# Altium schematic sheet JacdacRotary 26.SchDoc: Complete design
size A4; DocumentNumber: 1; SheetNumber: 1; SheetTotal: 1; VersionControl_RevNumber: 1
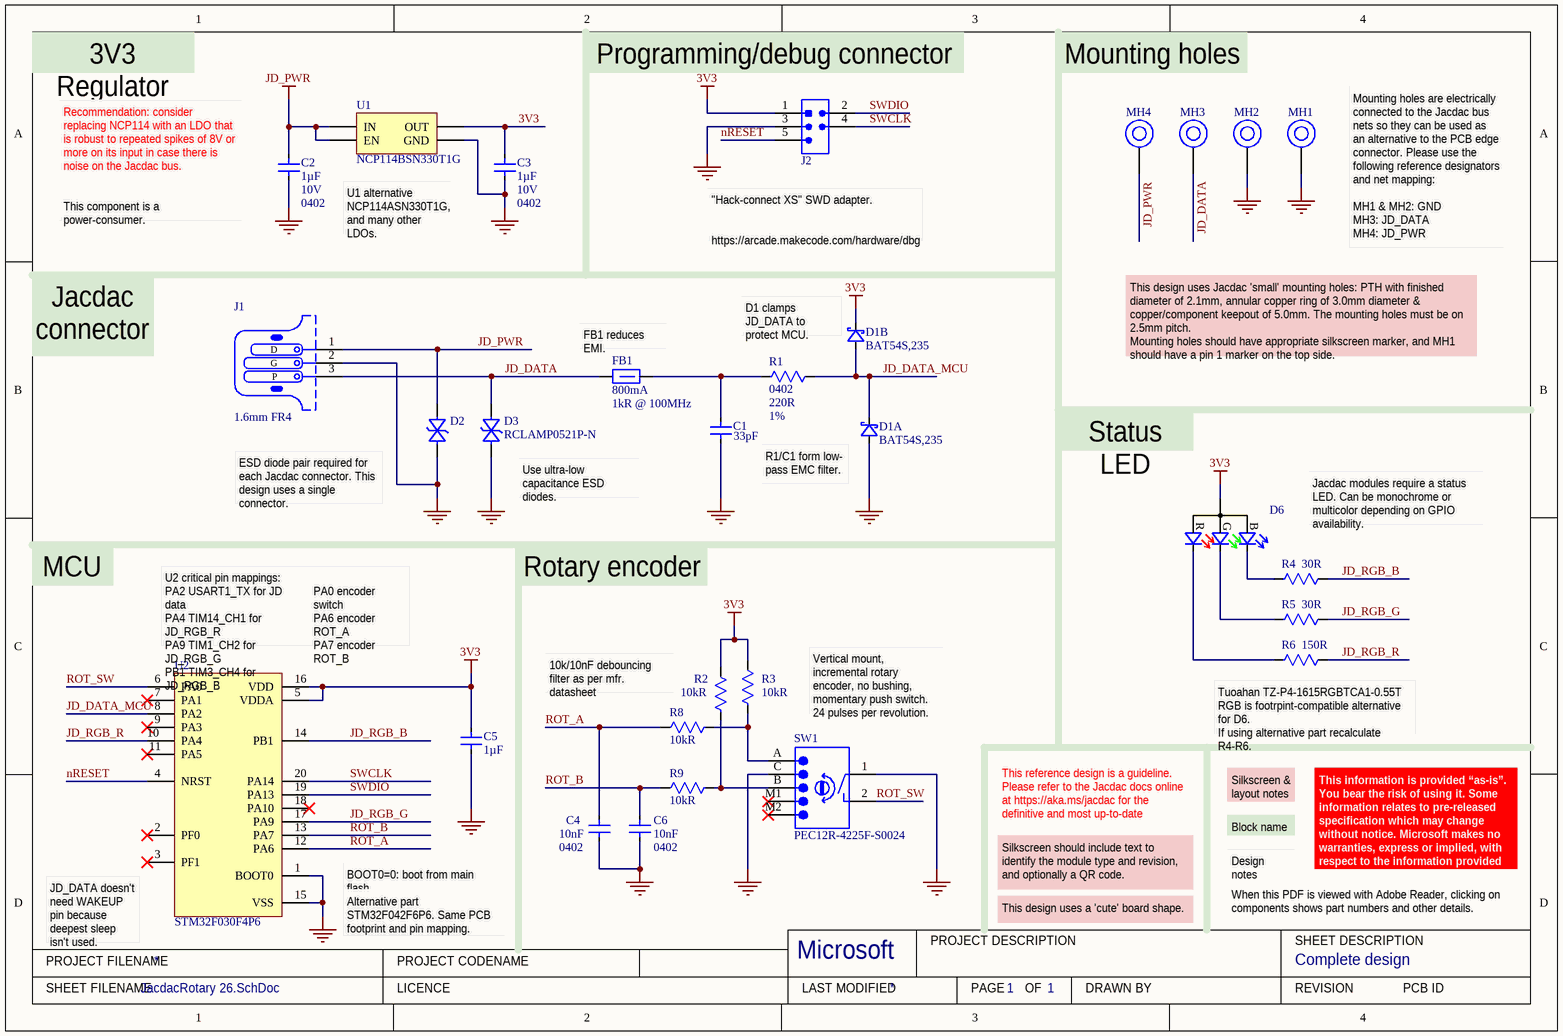
[diagram p0: JacdacRotary 26.SchDoc]

## Parts
C1  Capacitance: 33pF  [C0402_0.55MM - without outline]  (hidden comment: CL05C330JB5NNNC)
C2  Capacitance: 1µF  Voltage Rating: 10V  Case Code (Imperial): 0402  [C0402_0.55MM - without outline]  (hidden comment: CL05A105KP5NNNC)
C3  Capacitance: 1µF  Voltage Rating: 10V  Case Code (Imperial): 0402  [C0402_0.55MM - without outline]  (hidden comment: CL05A105KP5NNNC)
C4  Capacitance: 10nF  Case Code (Imperial): 0402  [C0402_0.55MM - without outline]  (hidden comment: CL05B103JO5NNNC)
C5  Capacitance: 1µF  [C0402_0.55MM - without outline]  (hidden comment: CL05A105KP5NNNC)
C6  Capacitance: 10nF  Case Code (Imperial): 0402  [C0402_0.55MM - without outline]  (hidden comment: CL05B103JO5NNNC)
D1  Manufacturer Part Number: BAT54S,235  [NXP-BAT54S-TO-236AB - without outline]  (hidden comment: BAT54S)  (parts A,B of 2)
D2  RCLAMP0521P-N  [TVS 0402 - L]  (value not drawn)
D3  RCLAMP0521P-N  [TVS 0402 - L]
D6  TZ-P4-1615RGBTCA1-0.55T  [TZ-P4-1615RGBTCA1-0.55T]  (value not drawn)
FB1  Current Rating: 800mA  Impedance: 1kR @ 100MHz  [TDK MPZ1608 0.8mm - without outline]  (hidden comment: TDK MPZ1608S102ATA00)
J1  PCB Type: 1.6mm FR4  [JACDAC_EDGE_CONNECTOR_NO_TRACES]  (hidden comment: 3 pin JACDAC edge connector)  (no BOM)
J2  Hack Connect Mini 1.27 mm pitch 2-row  [HACK_CONNECT_MINI_5_X_1_27]  (value not drawn)  (no BOM)
MH1  MH_5.0MMK_3.0MMC_2.1MMD_PTH  [MH_5.0MMK_3.0MMC_2.1MMD_PTH]  (value not drawn)  (no BOM)
MH2  MH_5.0MMK_3.0MMC_2.1MMD_PTH  [MH_5.0MMK_3.0MMC_2.1MMD_PTH]  (value not drawn)  (no BOM)
MH3  MH_5.0MMK_3.0MMC_2.1MMD_PTH  [MH_5.0MMK_3.0MMC_2.1MMD_PTH]  (value not drawn)  (no BOM)
MH4  MH_5.0MMK_3.0MMC_2.1MMD_PTH  [MH_5.0MMK_3.0MMC_2.1MMD_PTH]  (value not drawn)  (no BOM)
R1  Case Code (Imperial): 0402  Resistance: 220R  Tolerance: 1%  [R0402 - Without outline]  (hidden comment: RC0402FR-07220RL)
R2  Resistance: 10kR  [R0402 - Without outline]  (hidden comment: 10k)
R3  Resistance: 10kR  [R0402 - Without outline]  (hidden comment: 10k)
R4  Resistance: 30R  [R0402 - Without outline]  (hidden comment: RC0402FR-0730RL)
R5  Resistance: 30R  [R0402 - Without outline]  (hidden comment: RC0402FR-0730RL)
R6  Resistance: 150R  [R0402 - Without outline]  (hidden comment: RC0402FR-07150RL)
R8  Resistance: 10kR  [R0402 - Without outline]  (hidden comment: 10k)
R9  Resistance: 10kR  [R0402 - Without outline]  (hidden comment: 10k)
SW1  PEC12R-4225F-S0024  [PEC12R-4225F-S0024 -Standoff 2.4mm- Slotted MH]
U1  LDO 3.3V/300 mA  [ON_SEMI-SOT23-5 - without outline]  (value not drawn)
U2  STM32F030F4P6  [20-TSSOP - without outline]

## Nets
3V3: C3.2 C5.2 D1.2(K) D6.1(A) J2.1(VCC) R2.1 R3.1 U1.5(OUT) U2.5(VDDA) U2.16(VDD)
GND: C1.1 C2.1 C3.1 C4.1 C5.1 C6.1 D1.1(A) D2.2(A) D3.2(A) J1.2(G) J2.3(GND) MH1.1 MH2.1 SW1.1 SW1.C U1.2(GND) U2.1(BOOT0) U2.15(VSS)
JD_PWR: C2.2 D2.1(K) J1.1(D) MH4.1 U1.1(IN) U1.3(EN)
JD_DATA: D3.1(K) FB1.1 J1.3(P) MH3.1
JD_DATA_MCU: D1.3(K) R1.1 U2.8(PA2)
JD_RGB_B: R4.2 U2.14(PB1)
JD_RGB_G: R5.2 U2.17(PA9)
JD_RGB_R: R6.2 U2.10(PA4)
nRESET: J2.5(RESET) U2.4(NRST)
ROT_A: C4.2 R8.1 U2.12(PA6)
ROT_B: C6.2 R9.1 U2.13(PA7)
ROT_SW: SW1.2 U2.6(PA0)
SWCLK: J2.4(SWCLK) U2.20(PA14)
SWDIO: J2.2(SWDIO) U2.19(PA13)
NetC1_2: C1.2 FB1.2 R1.2
NetD6_2: D6.2(R) R6.1
NetD6_3: D6.3(G) R5.1
NetD6_4: D6.4(B) R4.1
NetR2_2: R2.2 R9.2 SW1.B
NetR3_2: R3.2 R8.2 SW1.A

Not connected (* = marked no-connect by the designer): SW1 M1* M2*; U2 2(PF0)* 3(PF1)* 7(PA1)* 9(PA3)* 11(PA5)* 18(PA10)*

## Notes on the sheet
- 3V3 Regulator
- (near J2) Programming/debug connector
- Mounting holes
- (near C2) Recommendation: consider replacing NCP114 with an LDO that is robust to repeated spikes of 8V or more on its input in case there is noise on the Jacdac bus.
- (near C2) This component is a power-consumer.
- U1 alternative
  NCP114ASN330T1G, and many other LDOs.
- (near J2) "Hack-connect XS" SWD adapter.
  https://arcade.makecode.com/hardware/dbg
- MH1 & MH2: GND
  MH3: JD_DATA
  MH4: JD_PWR
- (near MH1) Mounting holes are electrically connected to the Jacdac bus nets so they can be used as an alternative to the PCB edge connector. Please use the following reference designators and net mapping:
- Jacdac
  connector
- (near FB1) FB1 reduces EMI.
- (near D1) D1 clamps JD_DATA to protect MCU.
- This design uses Jacdac 'small' mounting holes: PTH with finished diameter of 2.1mm, annular copper ring of 3.0mm diameter & copper/component keepout of 5.0mm. The mounting holes must be on 2.5mm pitch.
  Mounting holes should have appropriate silkscreen marker, and MH1 should have a pin 1 marker on the top side.
- Status LED
- ESD diode pair required for each Jacdac connector. This design uses a single connector.
- (near D3) Use ultra-low capacitance ESD diodes.
- (near D1) R1/C1 form low-
  pass EMC filter.
- Jacdac modules require a status LED. Can be monochrome or multicolor depending on GPIO availability.
- MCU
- Rotary encoder
- (near U2) U2 critical pin mappings:
  PA2 USART1_TX for JD data
  PA4 TIM14_CH1 for JD_RGB_R
  PA9 TIM1_CH2 for JD_RGB_G
  PB1 TIM3_CH4 for JD_RGB_B
- (near U2) PA0 encoder switch
  PA6 encoder ROT_A
  PA7 encoder ROT_B
- 10k/10nF debouncing filter as per mfr. datasheet
- Vertical mount, incremental rotary encoder, no bushing, momentary push switch. 24 pulses per revolution.
- (near R6) Tuoahan TZ-P4-1615RGBTCA1-0.55T RGB is footrpint-compatible alternative for D6.
  If using alternative part recalculate R4-R6.
- This reference design is a guideline. Please refer to the Jacdac docs online at https://aka.ms/jacdac for the definitive and most up-to-date information.
- Block name
- Silkscreen & layout notes
- BOOT0=0: boot from main flash.
- This design uses a 'cute' board shape.
- Silkscreen should include text to identify the module type and revision, and optionally a QR code.
- Design notes
- When this PDF is viewed with Adobe Reader, clicking on components shows part numbers and other details.
- This information is provided “as-is”. You bear the risk of using it. Some information relates to pre-released specification which may change without notice. Microsoft makes no warranties, express or implied, with respect to the information provided here.
- (near U2) JD_DATA doesn't need WAKEUP pin because deepest sleep isn't used.
- Alternative part STM32F042F6P6. Same PCB footprint and pin mapping.
- PROJECT FILENAME
- PROJECT CODENAME
- Microsoft
- PROJECT DESCRIPTION
- SHEET DESCRIPTION
- SHEET FILENAME
- LICENCE
- LAST MODIFIED
- PAGE
- OF
- DRAWN BY
- REVISION
- PCB ID

## Library data of the parts
C1 = CL05C330JB5NNNC: CAP CER 33PF 50V C0G/NP0 0402; Manufacturer: Samsung; Material: Ceramic; Tolerance: 5%; Dielectric: C0G; Temperature Coefficient: 300ppm/°C; Supplier 1: Digi-Key; Manufacturer Part Number: CL05C330JB5NNNC; RoHS: Yes; Category: Ceramic Capacitors; Stock 1: 5436088; Pricing 1: 1=0.10000, 10=0.02300, 50=0.01260, 100=0.01040, 500=0.00740, 1000=0.00582, 2500=0.00529, 5000=0.00487 (USD); Mount: Surface Mount; Case Code (Metric): 1005; Case Code (Imperial): 0402; Contact Plating: Tin; Min Operating Temperature: -55°C; Max Operating Temperature: 125°C; Package Quantity: 1; Packaging: Tape and Reel; Voltage: 50V; Voltage Rating (DC): 50V; Series: CL; Construction: Flat; Length: 1mm; Width: 0.02inch; Height: 0.5mm; Thickness: 0.022inch; Depth: 0.5mm; Radiation Hardening: No; Lead Free: Lead Free; RoHS Compliant: Yes; ComponentLink1URL: https://datasheet.ciiva.com/15195/getdatasheetpartid-355282-15195687.pdf; ComponentLink1Description: Online datasheet; Supplier 2: Newark; Stock 2: 45340; Pricing 2: 1=0.12500, 25=0.02900, 100=0.01300, 250=0.01100, 500=0.00900, 1000=0.00600 (USD); Supplier 3: Mouser; Stock 3: 8877; Pricing 3: 1=0.10000, 10=0.01400, 50=0.01400, 100=0.01100, 1000=0.00600, 10000=0.00400 (USD); Supplier 4: Farnell; Stock 4: 10934; Pricing 4: 150=0.01120, 500=0.00860, 2500=0.00640, 5000=0.00550 (GBP); Supplier Part Number 4: 3013373RL; Supplier Part Number 3: 187-CL05C330JB5NNNC; Supplier Part Number 2: 82AC9259; Supplier Part Number 1: 1276-1272-1-ND; Voltage Rating: 50V; Case/Package: 0402
C2 C3 C5 = CL05A105KP5NNNC: CAP CER 1UF 10V X5R 0402; Manufacturer: Samsung; Material: Ceramic; Tolerance: 10%; Supplier 1: Digi-Key; Manufacturer Part Number: CL05A105KP5NNNC; RoHS: Yes; Category: Capacitors; Stock 1: 5705569; Pricing 1: 1=0.10000, 10=0.03900, 50=0.02100, 100=0.01720, 500=0.01228, 1000=0.00965, 2500=0.00877, 5000=0.00807 (USD); Mount: Surface Mount; Case/Package: 0402; Case Code (Metric): 1005; Contact Plating: Tin; Min Operating Temperature: -55°C; Max Operating Temperature: 85°C; Dielectric: X5R; Package Quantity: 1; Packaging: Tape and Reel; Length: 1mm; Height: 0.5mm; Width: 0.02inch; Thickness: 0.022inch; Depth: 0.5mm; Radiation Hardening: No; ComponentLink1URL: https://datasheet.ciiva.com/15195/getdatasheetpartid-358390-15195630.pdf; ComponentLink1Description: Online datasheet; Supplier 2: Mouser; Stock 2: 928941; Pricing 2: 1=0.10000, 10=0.04200, 100=0.01800, 500=0.01300, 1000=0.01000, 2500=0.00900 (USD); Supplier 3: Farnell; Stock 3: 53670; Pricing 3: 10=0.02450, 100=0.02000, 500=0.01310, 2500=0.00920, 5000=0.00810, 10000=0.00640, 50000=0.00490 (GBP); Supplier Part Number 3: 3013329; Supplier Part Number 2: 187-CL05A105KP5NNNC; Supplier Part Number 1: 1276-1076-1-ND; Created: DG; Checked: ?
  C5: Voltage Rating: 10V; Case Code (Imperial): 0402
C4 C6 = CL05B103JO5NNNC: CAP CER 10000PF 16V X7R 0402; Manufacturer: Samsung; Tolerance: 5%; Supplier 1: Digi-Key; Manufacturer Part Number: CL05B103JO5NNNC; RoHS: Yes; Category: Ceramic Capacitors; Stock 1: 24167; Pricing 1: 1=0.10000, 10=0.02800, 50=0.01520, 100=0.01250, 500=0.00890, 1000=0.00699, 2500=0.00635, 5000=0.00584 (USD); Mount: Surface Mount; Case/Package: 0402; Case Code (Metric): 1005; Min Operating Temperature: -55°C; Max Operating Temperature: 125°C; Dielectric: X7R; Package Quantity: 10000; Packaging: Tape and Reel; Voltage Rating: 16V; Series: CL; Construction: Flat; Voltage Rating (DC): 16V; Length: 1mm; Width: 0.02inch; Height: 0.5mm; Thickness: 0.022inch; Depth: 0.5mm; Radiation Hardening: No; RoHS Compliant: Yes; ComponentLink1URL: https://datasheet.ciiva.com/25738/cl05b103jo5nnnc-25738915.pdf?src-supplier=Digi-Key; ComponentLink1Description: Online datasheet; Supplier 2: Mouser; Stock 2: 86985; Pricing 2: 1=0.10000, 10=0.01600, 50=0.01600, 100=0.01300, 1000=0.00700, 10000=0.00500 (USD); Created By: D. Gakure; Checked By: ?; Supplier Part Number 1: 1276-1496-1-ND; Supplier Part Number 2: 187-CL05B103JO5NNNC
D1 = BAT54S: DIODE ARRAY SCHOTTKY 30V SOT23; Manufacturer: Nexperia; Supplier 1: Digi-Key; RoHS: No; Category: Rectifier Diodes; Stock 1: 14011; Pricing 1: 1=0.13000, 10=0.11900, 100=0.05610, 500=0.03326, 1000=0.02185, 5000=0.02138 (USD); ComponentLink1URL: https://assets.nexperia.com/documents/data-sheet/BAT54_SER.pdf; ComponentLink1Description: NXP datasheet online; Supplier 2: Mouser; Supplier 3: RSComponents; Supplier Part Number 2: 771-BAT54S235; Supplier Part Number 3: 1707990; Supplier Part Number 1: 1727-1868-1-ND
D2 D3 = RCLAMP0521P-N: Bidirectional 5V (Max) 6V 16V 3.5A (8/20us) 0402 TVS RoHS; Manufacturer: Born Semiconductor; Package: 0402; Created By: D Gakure; Checked By: ?; Supplier1: LCSC; Supplier1 Part Number: C316043; ComponentLink1Description: Online datasheet; ComponentLink1URL: https://datasheet.lcsc.com/szlcsc/Bourne-Semicon-Shenzhen-RCLAMP0521P-N_C316043.pdf; Manufacturer Part Number: RCLAMP0521P-N
D6 = TZ-P4-1615RGBTCA1-0.55T: 1615 Light Emitting Diodes (LED) RoHS; Manufacturer: TUOZHAN; Manufacturer Part Number: TZ-P4-1615RGBTCA1-0.55T; Category: Optoelectronics; Package: 1615; ComponentLink1Description: Online datasheet; ComponentLink1URL: https://datasheet.lcsc.com/szlcsc/2009041238_TUOZHAN-TZ-P4-1615RGBTCA1-0-55T_C779813.pdf; RoHS: RoHS Compliant; Supplier 1: LCSC; Size / Dimension: 1.6x1.5mm; Supplier 1 Part Number: C779813; Packaging: Tape & Reel (TR); Created By: D. Gakure; Checked By: ?
FB1 = TDK MPZ1608S102ATA00: 0603 1k@100MHz 0.8A chip; Core Material: Ferrite; Tolerance: 25%; DC Resistance (DCR): 300mR; Supplier 1: Digi-Key; Stock 1: 113542; Pricing 1: 1=0.1, 10=0.079, 25=0.0716, 50=0.0644, 100=0.0472, 250=0.03432, 500=0.03146, 1000=0.02717 (USD); Mount: Surface Mount; Case/Package: 0603; Case Code (Metric): 1608; Case Code (Imperial): 0603; Package Quantity: 4000; Packaging: Tape and Reel; Max DC Current: 800mA; Length: 0.063inch; Height: 0.037inch; Width: 0.031inch; ComponentLink2URL: https://www.mouser.co.uk/datasheet/2/400/eads_commercial_power_mpz1608_en-923650.pdf; ComponentLink2Description: datasheet online; Supplier 2: Mouser; ComponentLink3Description: datasheet; ComponentLink3URL: Y:\System\Altium\Libraries 2014\TDK\Datasheets\eads_commercial_power_mpz1608_en-923650.pdf; Supplier Part Number 1: 445-8694-1-ND; Supplier Part Number 2: 810-MPZ1608S102ATA00; Manufacturer: TDK; Manufacturer Part Number: MPZ1608S102ATA00
J1 = Jacdac edge connector: 3 pin Jacdac edge connector 1.27mm pitch; Manufacturer Part Number: JACDAC_EDGE_CONNECTOR; Checked By: ?; Created By: D. Gakure; ComponentLink1Description: Yuliang JACDAC cable connector drawing online; ComponentLink1URL: https://github.com/microsoft/jacdac-mdk/blob/main/connector/JACDAC-Connector-by-Yuliang-2020-11-28.pdf; ComponentLink2Description: JACDAC PCB edge connector spec onlin; ComponentLink2URL: https://github.com/microsoft/jacdac-mdk/blob/main/connector/JACDAC_PCB_Edge_Connector_Drawing_JD-PEC-01_rev_01.pdf
J2 = HACK_CONNECT_MINI
MH1-MH4 = MH_5.0MMK_3.0MMC_2.1MMD_PTH: Mounting Hole 5.0mm keepout, 3.0mm annualar ring and 2.1mm Drill PTH
R1 = RC0402FR-07220RL: RES SMD 220 OHM 1% 1/16W 0402; Manufacturer: Yageo; Power Rating: 62.5mW; Voltage Rating: 50V; Temperature Coefficient: 100ppm/°C; Max Power Dissipation: 63mW; Supplier 1: Digi-Key; Manufacturer Part Number: RC0402FR-07220RL; RoHS: Yes; Category: Resistors; Stock 1: 1286042; Pricing 1: 1=0.10000, 10=0.01400, 100=0.00580, 1000=0.00262, 2500=0.00228, 5000=0.00188 (USD); Case/Package: 0402; Number of Pins: 2; Case Code (Metric): 1005; Min Operating Temperature: -55°C; Max Operating Temperature: 155°C; Packaging: Tape and Reel; Voltage Rating (DC): 50V; Package Quantity: 1; Termination: SMD/SMT; Resistor Type: Thick Film; Number of Terminations: 2; Features: Moisture Resistant; Length: 1mm; Height: 0.016inch; Width: 0.02inch; Depth: 0.5mm; REACH SVHC: No SVHC; Military Standard: Not; Lead Free: Lead Free; ComponentLink1URL: https://datasheet.ciiva.com/11819/0900766b80c66297-11819466.pdf; ComponentLink1Description: Online datasheet; Supplier 2: Mouser; Stock 2: 324625; Pricing 2: 1=0.10000, 10=0.01200, 100=0.00400, 1000=0.00400, 2500=0.00400, 10000=0.00300 (USD); Supplier 3: Farnell; Stock 3: 18234; Pricing 3: 1=0.08130, 25=0.01210, 100=0.01120, 250=0.01030, 500=0.00900 (GBP); Supplier Part Number 3: 2147864; Supplier Part Number 2: 603-RC0402FR-07220RL; Supplier Part Number 1: 311-220LRCT-ND; Created: D.G; Checked: ?
R2 R3 R8 R9 = RC0402FR-0710KL: RES SMD 10K OHM 1% 1/16W 0402; Manufacturer: Yageo; Temperature Coefficient: 100ppm/°C; Voltage Rating (DC): 50V; Power Rating: 62.5mW; Supplier 1: Digi-Key; Manufacturer Part Number: RC0402FR-0710KL; RoHS: Yes; Category: Resistors; Stock 1: 40173593; Pricing 1: 1=0.10000, 10=0.01400, 100=0.00580, 1000=0.00262, 2500=0.00228, 5000=0.00188 (USD); Case/Package: 0402; Number of Pins: 2; Case Code (Metric): 1005; Min Operating Temperature: -55°C; Max Operating Temperature: 155°C; Resistor Type: Thick Film; Packaging: Tape and Reel; Voltage Rating: 50V; Termination: SMD/SMT; Working Voltage: 50V; Number of Terminations: 2; Length: 1mm; Height: 0.32mm; Width: 0.5mm; Depth: 0.5mm; Lead Pitch: 0.2mm; REACH SVHC: No SVHC; Lead Free: Lead Free; Military Standard: Not; ComponentLink1URL: https://datasheet.ciiva.com/7660/38568-7660787.pdf?src-supplier=Element14; ComponentLink1Description: https://datasheet.ciiva.com/7660/38568-7660787.pdf?src-supplier=Element14; ComponentLink2URL: https://datasheet.ciiva.com/7849/1784430-7849813.pdf?src-supplier=Element14; ComponentLink2Description: https://datasheet.ciiva.com/7849/1784430-7849813.pdf?src-supplier=Element14; ComponentLink3URL: https://datasheet.ciiva.com/7849/1686128-7849814.pdf?src-supplier=Element14; ComponentLink3Description: https://datasheet.ciiva.com/7849/1686128-7849814.pdf?src-supplier=Element14; ComponentLink4URL: https://datasheet.ciiva.com/7849/1784430-7849815.pdf?src-supplier=Element14; ComponentLink4Description: https://datasheet.ciiva.com/7849/1784430-7849815.pdf?src-supplier=Element14; ComponentLink5URL: https://datasheet.ciiva.com/22747/1018594-22747512.pdf?src-supplier=Element14; ComponentLink5Description: https://datasheet.ciiva.com/22747/1018594-22747512.pdf?src-supplier=Element14; ComponentLink6URL: https://datasheet.ciiva.com/12667/pyu-rc0402-51-rohs-l-6-r-12667067.pdf?src-supplier=Mouser; ComponentLink6Description: https://datasheet.ciiva.com/12667/pyu-rc0402-51-rohs-l-6-r-12667067.pdf?src-supplier=Mouser; ComponentLink7URL: https://datasheet.ciiva.com/7983/1018594-7983486.pdf?src-supplier=Element14; ComponentLink7Description: https://datasheet.ciiva.com/7983/1018594-7983486.pdf?src-supplier=Element14; Supplier 2: Mouser; Stock 2: 23672167; Pricing 2: 1=0.10000, 10=0.01300, 100=0.00400, 1000=0.00300, 2500=0.00300, 10000=0.00200 (USD); Supplier 3: Farnell; Stock 3: 370000; Pricing 3: 10000=0.00350 (GBP); Checked: ?; Created: DG; Supplier Part Number 1: 311-10.0KLRCT-ND; Supplier Part Number 2: 603-RC0402FR-0710KL; Supplier Part Number 3: 2363463; Tolerance: 1%; Case Code (Imperial): 0402
R4 R5 = RC0402FR-0730RL: RES SMD 30 OHM 1% 1/16W 0402; Manufacturer: Yageo; Temperature Coefficient: 100ppm/°C; Power Rating: 63mW; Voltage Rating: 50V; Supplier 1: Digi-Key; Manufacturer Part Number: RC0402FR-0730RL; RoHS: Yes; Category: Chip SMD Resistors; Stock 1: 2973; Pricing 1: 1=0.10000, 10=0.01400, 100=0.00580, 1000=0.00260, 2500=0.00226, 5000=0.00186 (USD); Case/Package: 0402; Contact Plating: Tin,Matte; Case Code (Metric): 1005; Size Code: 0402; Min Operating Temperature: -55°C; Max Operating Temperature: 155°C; Resistor Type: Thick Film; Packaging: Tape and Reel; Termination: SMD/SMT; Voltage Rating (DC): 50V; Features: Moisture Resistant; Series: RC; Max Power Dissipation: 63mW; Number of Terminations: 2; Construction: Rectangular; Resistance Tolerance: 1%; Length: 1mm; Width: 0.5mm; Height: 0.35mm; Depth: 0.5mm; REACH SVHC: Unknown; Military Standard: Not; Lead Free: Lead Free; RoHS Compliant: Yes; ComponentLink1URL: https://datasheet.ciiva.com/7849/1018594-7849958.pdf; ComponentLink1Description: Online datasheet; Supplier 2: Mouser; Stock 2: 41804; Pricing 2: 1=0.10000, 10=0.01200, 50=0.01200, 100=0.00400, 1000=0.00400, 10000=0.00300 (USD); Supplier 3: Farnell; Stock 3: 4422; Pricing 3: 10=0.01210, 100=0.00420, 500=0.00370, 2500=0.00280, 5000=0.00250, 10000=0.00230, 50000=0.00150 (GBP); Supplier Part Number 3: 1458775; Supplier Part Number 2: 603-RC0402FR-0730RL; Supplier Part Number 1: 311-30LRCT-ND; Created By: D. Gakure; Checked By: ?; Tolerance: 1%; Case Code (Imperial): 0402
R6 = RC0402FR-07150RL: RES SMD 150 OHM 1% 1/16W 0402; Manufacturer: Yageo; Power Rating: 62.5mW; Voltage Rating: 50V; Temperature Coefficient: 100ppm/°C; Max Power Dissipation: 63mW; Supplier 1: Digi-Key; Manufacturer Part Number: RC0402FR-07150RL; RoHS: Yes; Category: Chip SMD Resistors; Stock 1: 5214533; Pricing 1: 1=0.10000, 10=0.01400, 100=0.00580, 1000=0.00260, 2500=0.00226, 5000=0.00186 (USD); Case/Package: 0402; Case Code (Metric): 1005; Min Operating Temperature: -55°C; Max Operating Temperature: 155°C; Packaging: Tape and Reel; Package Quantity: 1; Resistor Type: Thick Film; Number of Terminations: 2; Termination: SMD/SMT; Working Voltage: 50V; Features: Moisture Resistant; Series: RC; Resistance Tolerance: 1%; Construction: Rectangular; Technology: THICK FILM; Length: 1mm; Width: 0.02inch; Height: 0.016inch; Depth: 0.5mm; REACH SVHC: No SVHC; Military Standard: Not; Lead Free: Lead Free; RoHS Compliant: Yes; ComponentLink1URL: https://datasheet.ciiva.com/11808/0900766b80c66297-11808422.pdf; ComponentLink1Description: ine datasheet; Supplier 2: Mouser; Stock 2: 582717; Pricing 2: 1=0.10000, 10=0.01200, 50=0.01200, 100=0.00400, 1000=0.00400, 10000=0.00300 (USD); Supplier 3: Farnell; Stock 3: 880000; Pricing 3: 10000=0.00270, 50000=0.00200 (GBP); Created by: D. Gakure; Checked By: ?; Supplier Part Number 3: 2421893; Supplier Part Number 2: 603-RC0402FR-07150RL; Supplier Part Number 1: 311-150LRCT-ND; Tolerance: 1%; Case Code (Imperial): 0402
SW1 = PEC12R-4225F-S0024: Rotary Encoder Mechanical 24 Quadrature (Incremental) Vertical; Manufacturer: Bourns; Number of Channels: 2; Pulses per Revolution: 24; Detent: Yes; Output Type: Quadrature,Incremental; Hole Diameter: 1mm; Supplier 1: Digi-Key; Manufacturer Part Number: PEC12R-4225F-S0024; RoHS: Yes; Category: Switch Accessories; Stock 1: 6612; Pricing 1: 1=1.16000, 5=1.11800, 10=1.07500, 25=1.01040, 50=0.92440, 100=0.79550, 250=0.75248, 500=0.70950, 1000=0.68800 (USD); Mount: Through Hole,PCB; Min Operating Temperature: -30°C; Max Operating Temperature: 70°C; Packaging: Bulk; Package Quantity: 75; Termination: PC Pin; Orientation: Vertical; Encoder Type: Mechanical; Built in Switch: Yes; Series: PEC12R; Length: 13.4mm; Width: 12.5mm; Height: 13.4mm; RoHS Compliant: Yes; REACH SVHC: No SVHC; ComponentLink1URL: https://datasheet.ciiva.com/30488/0900766b81273a18-30488727.pdf; ComponentLink1Description: Online datasheet; Supplier 2: Farnell; Stock 2: 1084; Pricing 2: 1=1.37000, 5=1.13000, 10=0.96000, 20=0.89300, 40=0.80000, 75=0.69800, 375=0.59100 (GBP); Supplier 3: Mouser; Stock 3: 1691; Pricing 3: 1=1.12000, 10=0.98400, 50=0.89900, 100=0.77800, 1000=0.68800, 10000=0.64700 (USD); Supplier 4: RSComponents; Stock 4: 174; Pricing 4: 1=1.26900, 10=1.04400, 25=0.91200, 100=0.76700, 250=0.74000 (USD); Supplier 5: RSComponents; Stock 5: 1254; Pricing 5: 10=1.04400, 25=0.91200, 100=0.76700, 250=0.74000 (USD); Supplier Part Number 5: 7816811P; Supplier Part Number 3: 652-PEC12R-4225F-S24; Supplier Part Number 2: 2663533; Supplier Part Number 1: PEC12R-4225F-S0024-ND; Supplier Part Number 4: 7816811; Created By: D. Gakure; Checked By: ?
U1 = NCP114BSN330T1G: CMOS Low Dropout Regulator (LDO), 300 mA 3.3V, Non-Active Discharge, TSOP5; Manufacturer: ON Semiconductor; Polarity: Positive; Quiescent Current: 50uA; Max Input Voltage: 5.5V; Min Input Voltage: 1.7V; Max Output Current: 300mA; Number of Outputs: 1; Accuracy: 2%; Output Type: Fixed; Supplier 1: Digi-Key; RoHS: Yes; Category: Voltage Regulators - Linear; Stock 1: 4067; Pricing 1: 1=0.45000, 10=0.33700, 25=0.29440, 100=0.19060, 250=0.15780, 500=0.12624, 1000=0.09679 (USD); Mount: Surface Mount; Case/Package: TSOP; Number of Pins: 5; Min Operating Temperature: -40°C; Max Operating Temperature: 85°C; Output Voltage: 3.3V; Lead Free: Lead Free; RoHS Compliant: Yes; ComponentLink1URL: http://www.farnell.com/datasheets/2118270.pdf?src-supplier=Farnell; ComponentLink1Description: Datasheet (online); Supplier 2: Mouser; Supplier 3: RSComponents; Supplier Part Number 2: 863-NCP114BSN330T1G; Supplier Part Number 3: 1263179; Supplier Part Number 1: NCP114BSN330T1GOSCT-ND; Manufacturer Part Number: NCP114BSN330T1G
U2 = ST STM32F030F4P6: ARM Cortex-M0 STM32F0 Microcontroller IC 32-Bit 48MHz 16KB (16K x 8) FLASH; Manufacturer: STMicroelectronics; Max Supply Voltage: 3.6V; Interface: I2C,SPI,UART,USART; RAM Size: 4KB; Max Power Dissipation: 182mW; Number of I/Os: 15; Number of Timers/Counters: 5; Min Supply Voltage: 2.4V; Number of ADC Channels: 16; Oscillator Type: Internal; Data Bus Width: 32b; Number of SPI Channels: 1; Watchdog Timer: Yes; Peripherals: POR,PWM,WDT,DMA; Number of PWM Channels: 6; Categories: Integrated Circuits; Supplier 1: Farnell; RoHS: Yes; Category: Microcontrollers; Stock 1: 1196; Pricing 1: 1=0.97500, 25=0.85400, 50=0.75500, 100=0.65600, 250=0.61800, 500=0.58000, 1000=0.52500, 2500=0.46900 (GBP); Case/Package: TSSOP; Number of Pins: 20; Contact Plating: Gold; Min Operating Temperature: -40°C; Max Operating Temperature: 85°C; Package Quantity: 74; Frequency: 48MHz; Packaging: Rail/Tube; Number of Programmable I/O: 15; Max Frequency: 48MHz; Number of I2C Channels: 1; Memory Type: FLASH; Memory Size: 16KB; Core Architecture: ARM; Length: 6.6mm; Height: 1.05mm; Width: 4.5mm; Radiation Hardening: No; REACH SVHC: No SVHC; Lead Free: Lead Free; ComponentLink1URL: https://datasheet.ciiva.com/29720/dm00088500-29720640.pdf; ComponentLink1Description: Online datasheet; Supplier Part Number 1: 2393635; Created: DG; Checked: ?; Supplier Part Number 2: 497-14044-5-ND; Supplier 2: Digi-Key; Supplier 3: RSComponents; Stock 3: 48; Pricing 3: 100=0.43900, 250=0.38800, 1000=0.37300 (GBP); Supplier Part Number 3: 7925925P; Manufacturer Part Number: STM32F030F4P6; Created By: D. Gakure; Checked By: ?